# EAGLE design schematic (EAGLE 7.3.0)
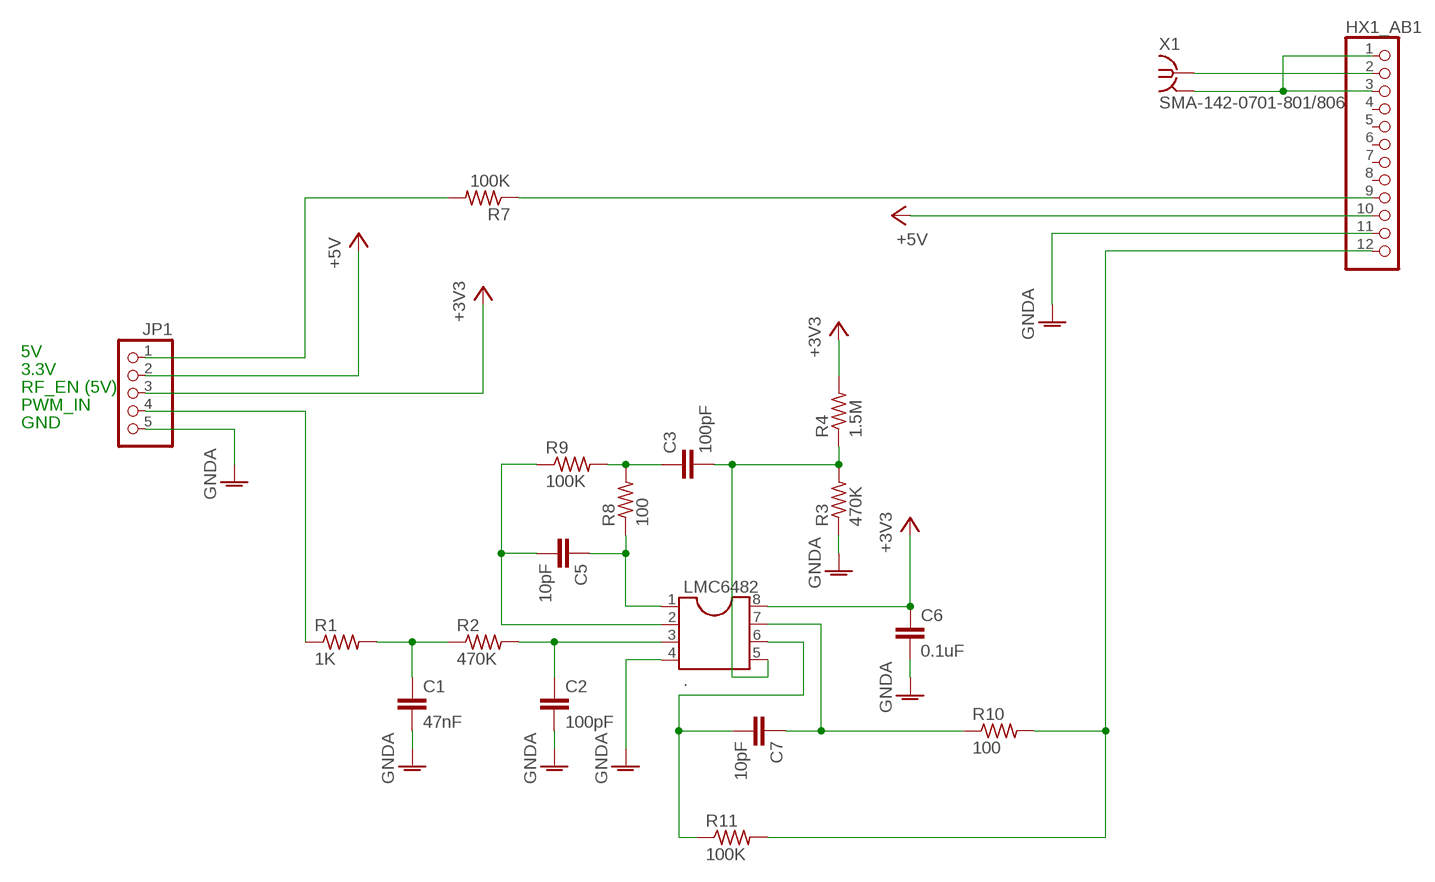
[diagram p0: schematic, sheet 1]

## Parts
C1  47nF  C2.5/2  [C2.5-2]
C2  100pF  C2.5/2  [C2.5-2]
C3  100pF  C2.5/2  [C2.5-2]
C5  10pF  C2.5/2  [C2.5-2]
C6  0.1uF  C2.5/2  [C2.5-2]
C7  10pF  C2.5/2  [C2.5-2]
HX1_AB1  PINHD-1X12  [1X12]
JP1  PINHD-1X5  [1X05]
LMC6482  .  DIL8  [DIL08]
R1  1K  R-US_0204/2V  [0204V]
R2  470K  R-US_0204/2V  [0204V]
R3  470K  R-US_0204/2V  [0204V]
R4  1.5M  R-US_0204/2V  [0204V]
R7  100K  R-US_0204/2V  [0204V]
R8  100  R-US_0204/2V  [0204V]
R9  100K  R-US_0204/2V  [0204V]
R10  100  R-US_0204/2V  [0204V]
R11  100K  R-US_0204/2V  [0204V]
X1  SMA-142-0701-801/806  [J502-ND-142-0701-801/806]

## Nets
+3V3: C6.1 JP1.3 LMC6482.8 R4.2
+5V: HX1_AB1.10 JP1.2
GNDA: C1.2 C2.2 C6.2 HX1_AB1.11 JP1.5 LMC6482.4 R3.1
N$1: JP1.4 R1.1
N$2: C1.1 R1.2 R2.1
N$3: C2.1 LMC6482.3 R2.2
N$4: C7.2 LMC6482.6 R11.1
N$7: C3.2 LMC6482.5 R3.2 R4.1
N$8: C3.1 R8.2 R9.2
N$9: HX1_AB1.2 X1.1
N$10: HX1_AB1.1 HX1_AB1.3 X1.G@1 X1.G@2 X1.G@3 X1.G@4
N$11: HX1_AB1.9 R7.1
N$12: C7.1 LMC6482.7 R10.1
N$13: C5.1 LMC6482.1 R8.1
N$14: HX1_AB1.12 R10.2 R11.2
N$15: C5.2 LMC6482.2 R9.1
N$18: JP1.1 R7.2
Unconnected: HX1_AB1.4 HX1_AB1.5 HX1_AB1.6 HX1_AB1.7 HX1_AB1.8

## Notes on the sheet
- 5V
- 3.3V
- RF_EN (5V)
- PWM_IN
- GND

## Library data of the parts
C1-C3 C5-C7 = capacitor-wima:C: CAPACITOR naming: grid - package width
HX1_AB1 = pinhead:PINHD-1X12: PIN HEADER
JP1 = pinhead:PINHD-1X5: PIN HEADER
LMC6482 = ic-package:DIL8: Dual In Line / Socket
R1-R4 R7-R11 = resistor:R-US_: RESISTOR, American symbol
X1 = con-coax:SMA-: SMA 50 Ohm End Launch Jack Receptacle - Round Contact Johnson Components Source: www.johnsoncomponents.com .. J502-ND.pdf; MF: JOHNSON COMPONENTS; MPN: 142-0701-801; OC_FARNELL: 1608592; OC_NEWARK: 90F2624

## Board
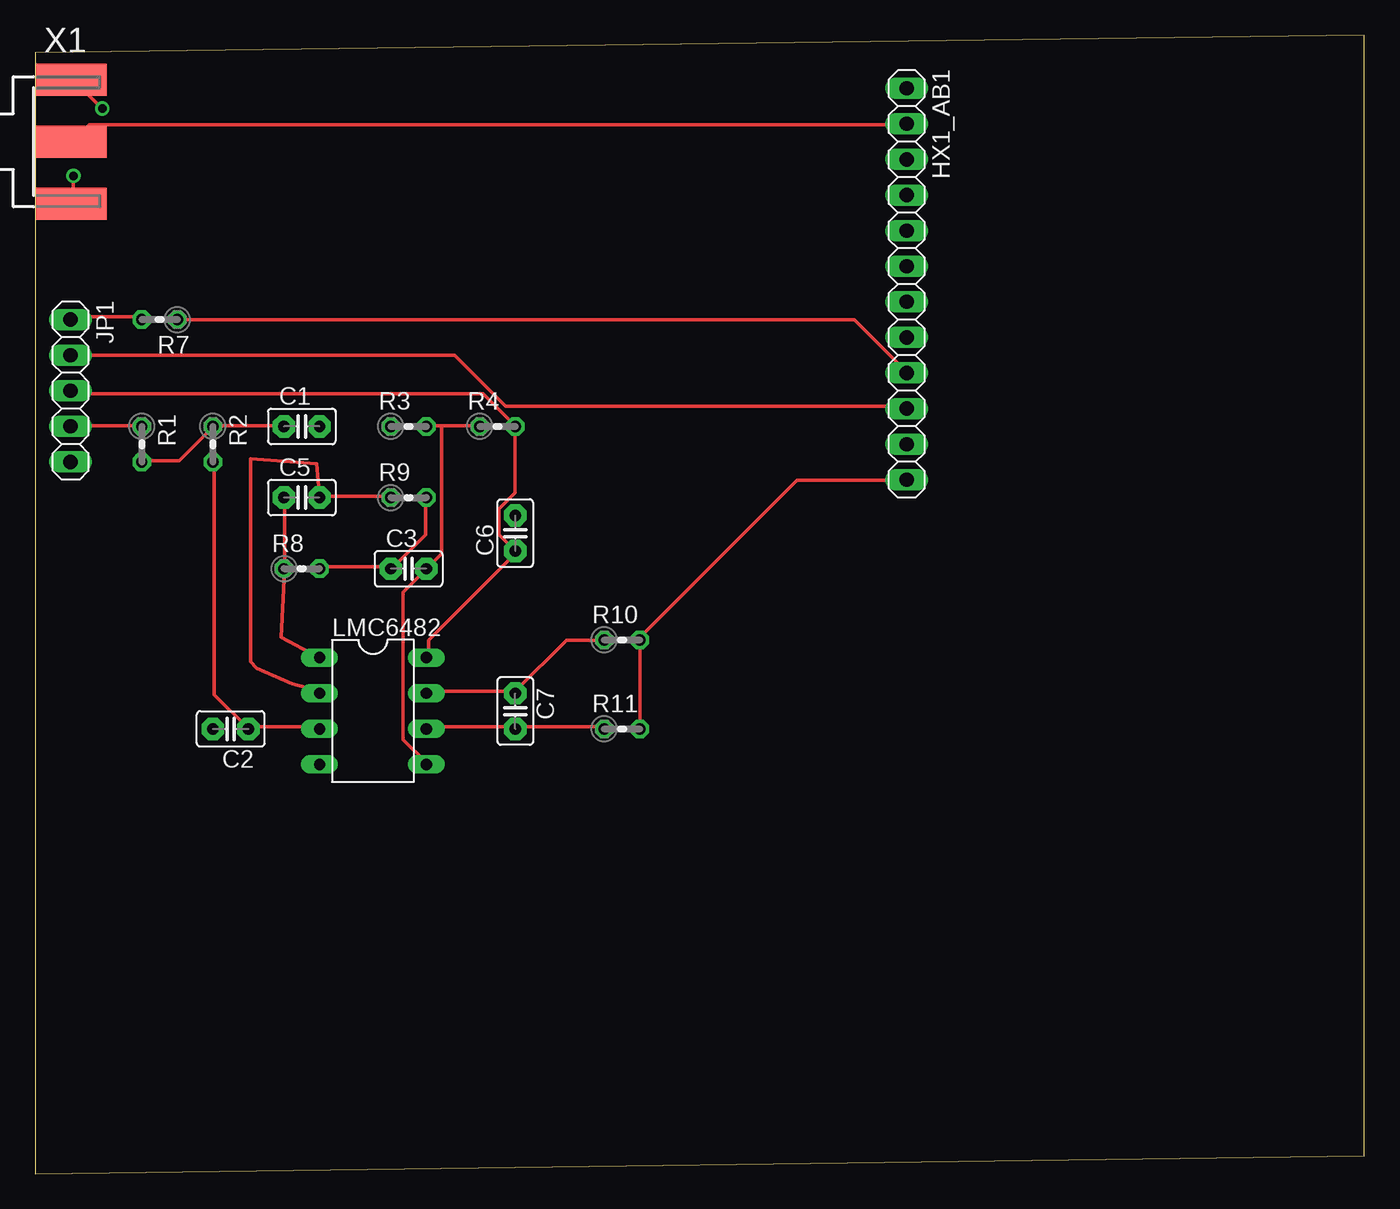
[diagram p1: board, top side]
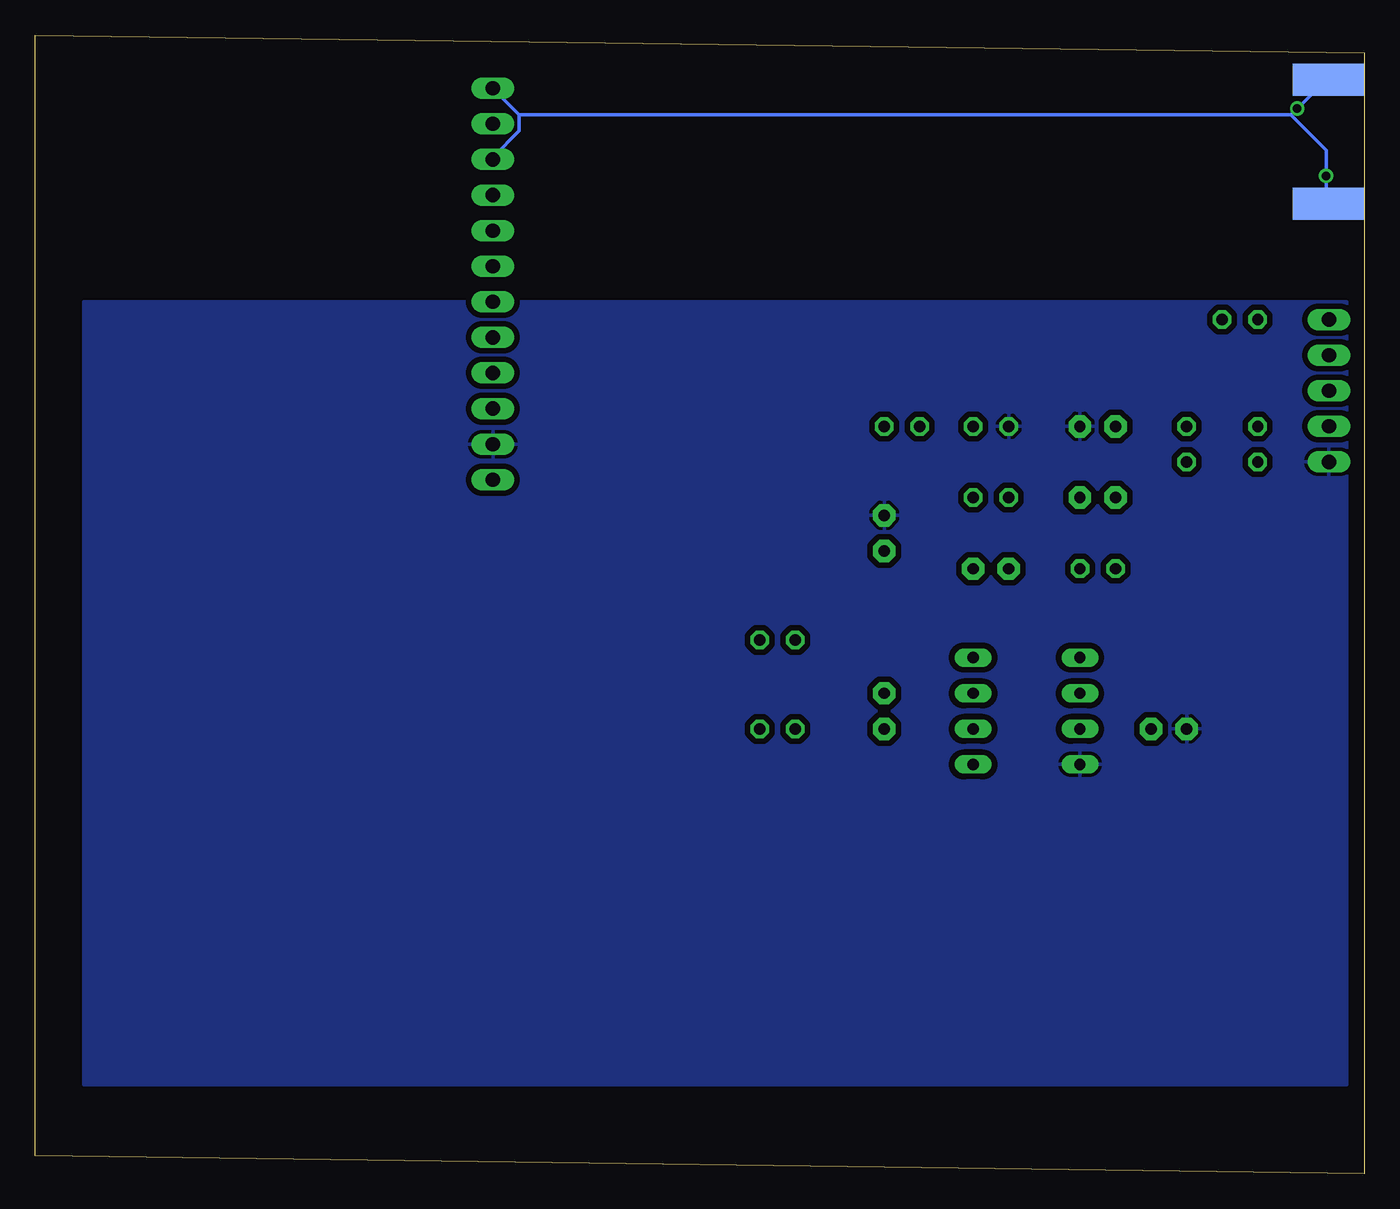
[diagram p2: board, bottom side, seen from below]

Size 94.92 x 81.27 mm. Coordinates in mm from the lower left corner, seen from the top.
Outline: 0,0 94.92,1.27 94.92,81.27 0,80 0,0
Copper layers (1*16): Top 0.035mm / dielectric 1.5mm / Bottom 0.035mm
Design rules "default": minimum track width 10mil, minimum drill 24mil, track to track 8mil, track to pad 8mil, pad to pad 8mil, via to via 8mil, smd to smd 8mil, copper to edge 40mil, drill to drill 8mil, minimum pad ring 10mil, minimum via ring 8mil, stop-mask expansion 4mil, vias tented up to drill 0mil, thermal gap 10mil

### Footprints (pad centres in the part's own frame; a part is rotated, then mirrored left to right if it is on the bottom)
C2.5-2 = drill 0.813 pad 1.6 octagon: 1 -1.27,0; 2 1.27,0
1X12 = drill 1.016 long: 1 -13.97,0; 2 -11.43,0; 3 -8.89,0; 4 -6.35,0; 5 -3.81,0; 6 -1.27,0; 7 1.27,0; 8 3.81,0; 9 6.35,0; 10 8.89,0; 11 11.43,0; 12 13.97,0
1X05 = drill 1.016 long: 1 -5.08,0; 2 -2.54,0; 3 0,0; 4 2.54,0; 5 5.08,0
DIL08 = drill 0.813 long: 1 -3.81,-3.81; 2 -1.27,-3.81; 3 1.27,-3.81; 4 3.81,-3.81; 5 3.81,3.81; 6 1.27,3.81; 7 -1.27,3.81; 8 -3.81,3.81
0204V = drill 0.813 octagon: 1 -1.27,0; 2 1.27,0
J502-ND-142-0701-801/806 = smd 5.08 x 2.286: 1 2.565,0; G@1 2.565,4.42; G@2 2.565,-4.42 | smd 5.08 x 2.286 bottom: G@3 2.565,4.42; G@4 2.565,-4.42

### Placement (x,y rotation side)
C1  19.05,53.34 0 top
C2  13.97,31.75 180 top
C3  26.67,43.18 0 top
C5  19.05,48.26 0 top
C6  34.29,45.72 90 top
C7  34.29,33.02 270 top
HX1_AB1  62.23,63.5 270 top
JP1  2.54,55.88 270 top
LMC6482  24.13,33.02 270 top
R1  7.62,52.07 270 top
R2  12.7,52.07 270 top
R3  26.67,53.34 0 top
R4  33.02,53.34 0 top
R7  8.89,60.96 180 top
R8  19.05,43.18 0 top
R9  26.67,48.26 0 top
R10  41.91,38.1 0 top
R11  41.91,31.75 0 top
X1  0,73.66 0 top

### Tracks (layer width: path | path; a pad name or v marks a point on that pad's centre or on a via)
+3V3
  Top 0.254: LMC6482.8 28.12,36.93 28.12,38.08 34.29,44.25 C6.1 34.29,44.48 33.15,45.62 33.15,47.45 34.29,48.59 R4.2 34.29,53.39 32,55.68 2.74,55.68 JP1.3
+5V
  Top 0.254: JP1.2 29.95,58.42 33.6,54.76 62.18,54.76 HX1_AB1.10
GNDA
  pour Bottom (isolate 0.406): 1.27,62.23 91.44,62.23 91.44,6.35 2.54,6.35 1.27,6.35
N$1
  Top 0.254: R1.1 7.54,53.39 2.74,53.39 JP1.4
N$2
  Top 0.254: R1.2 7.77,50.88 10.29,50.88 12.57,53.16 R2.1 12.8,53.39 17.6,53.39 C1.1
N$3
  Top 0.254: LMC6482.3 20.12,31.9 15.32,31.9 C2.1 12.8,34.19 12.8,50.65 R2.2
N$4
  Top 0.254: 34.29,31.9 28.12,31.9 LMC6482.6 | 34.29,31.9 40.46,31.9 R11.1 | 34.29,31.9 C7.2
N$7
  Top 0.254: 29.03,53.39 31.55,53.39 R4.1 | 29.03,53.39 28.12,53.39 R3.2 | LMC6482.5 27.89,29.39 26.29,30.99 26.29,41.5 27.89,43.1 C3.2 28.12,43.33 29.03,44.25 29.03,53.39
N$8
  Top 0.254: R8.2 20.34,43.33 25.38,43.33 C3.1 25.6,43.33 27.89,45.62 27.89,48.13 R9.2
N$9
  Top 0.254: HX1_AB1.2 62.18,74.88 3.89,74.88 2.74,73.74 X1.1
N$10  (via drill 0.61)
  Top 0.254: v2.74,71.22 2.74,69.39 X1.G@2 | v4.8,76.02 2.74,78.08 X1.G@3
  Bottom 0.254: X1.G@2 2.74,69.39 v2.74,71.22 2.74,73.05 5.26,75.56 | 60.35,75.56 60.35,74.42 62.18,72.59 HX1_AB1.3 | 60.35,75.56 62.18,77.39 HX1_AB1.1 | 5.26,75.56 60.35,75.56 | 5.26,75.56 v4.8,76.02 2.74,78.08 X1.G@3
N$11
  Top 0.254: R7.1 10.29,60.94 58.52,60.94 62.18,57.28 HX1_AB1.9
N$12
  Top 0.254: 34.29,34.42 28.12,34.42 LMC6482.7 | 34.29,34.42 37.95,38.08 40.46,38.08 R10.1 | 34.29,34.42 C7.1
N$13
  Top 0.254: C5.1 17.83,48.13 17.83,43.33 R8.1 17.83,43.1 17.58,38.28 20.12,36.93 LMC6482.1
N$14
  Top 0.254: R11.2 43.2,31.9 43.2,38.08 R10.2 43.2,38.3 54.41,49.51 62.18,49.51 HX1_AB1.12
N$15
  Top 0.254: LMC6482.2 20.34,34.42 18.36,34.98 15.82,36.09 15.39,36.53 15.39,51.03 20.12,50.67 C5.2 20.34,48.36 25.38,48.36 R9.1
N$18
  Top 0.254: R7.2 7.54,61.16 2.74,61.16 JP1.1